# EAGLE board Schematic_rfclock_uwb (EAGLE 9.6.2)
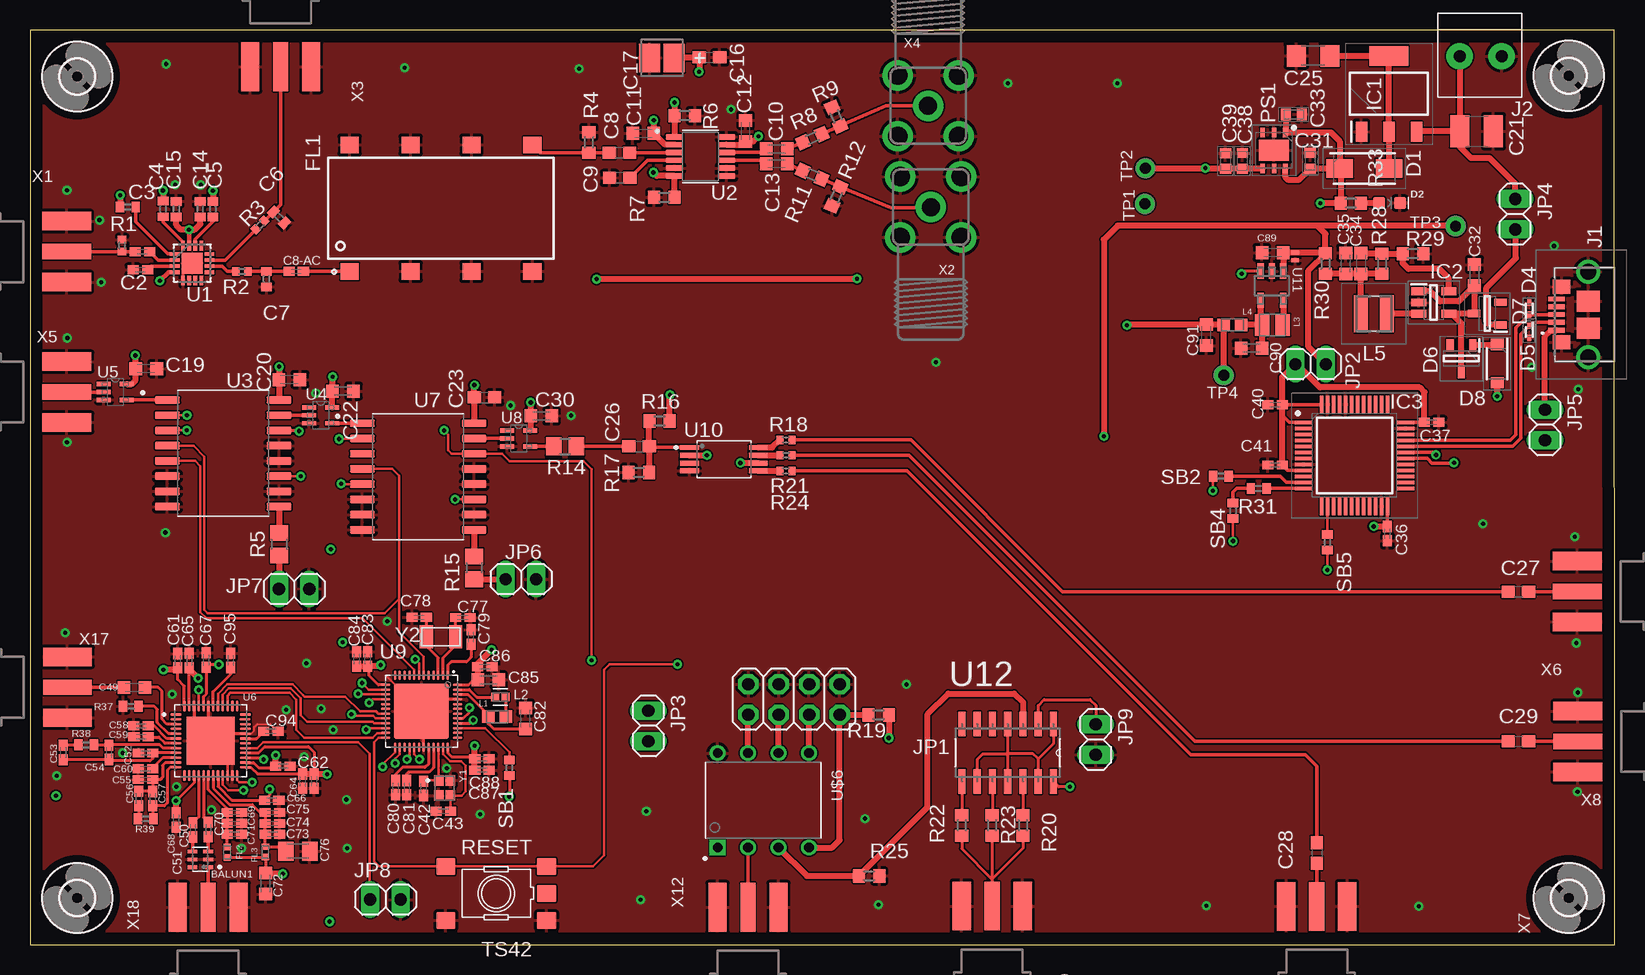
[diagram p5: board, top side]
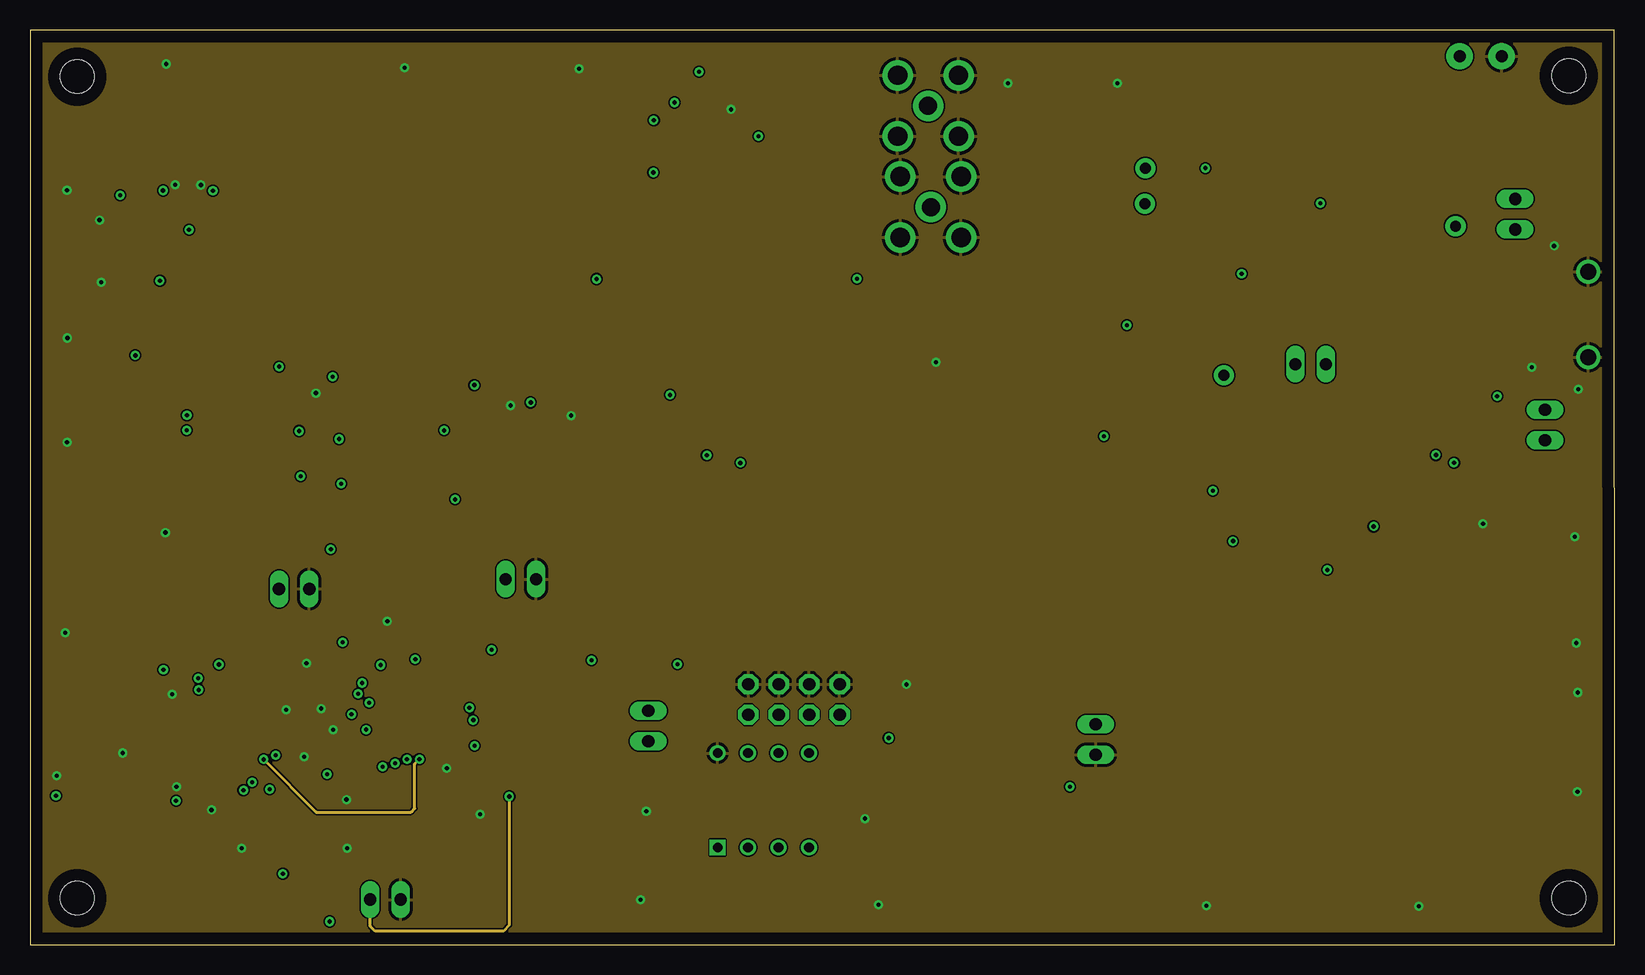
[diagram p6: board, inner layer Route2]
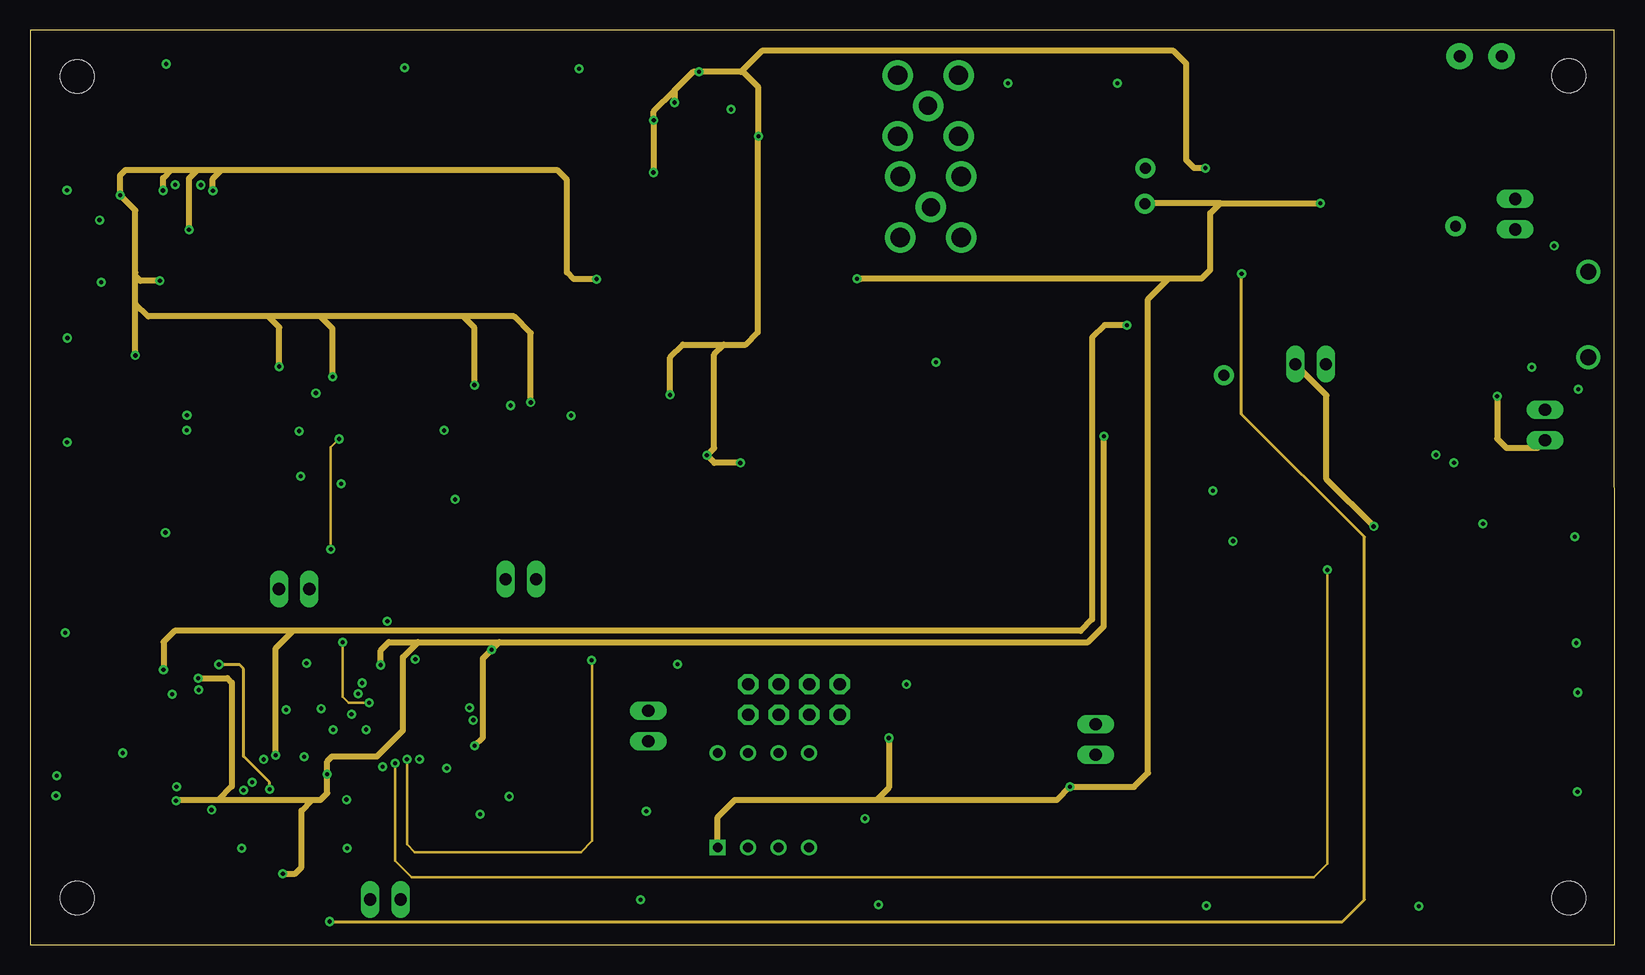
[diagram p7: board, inner layer Route15]
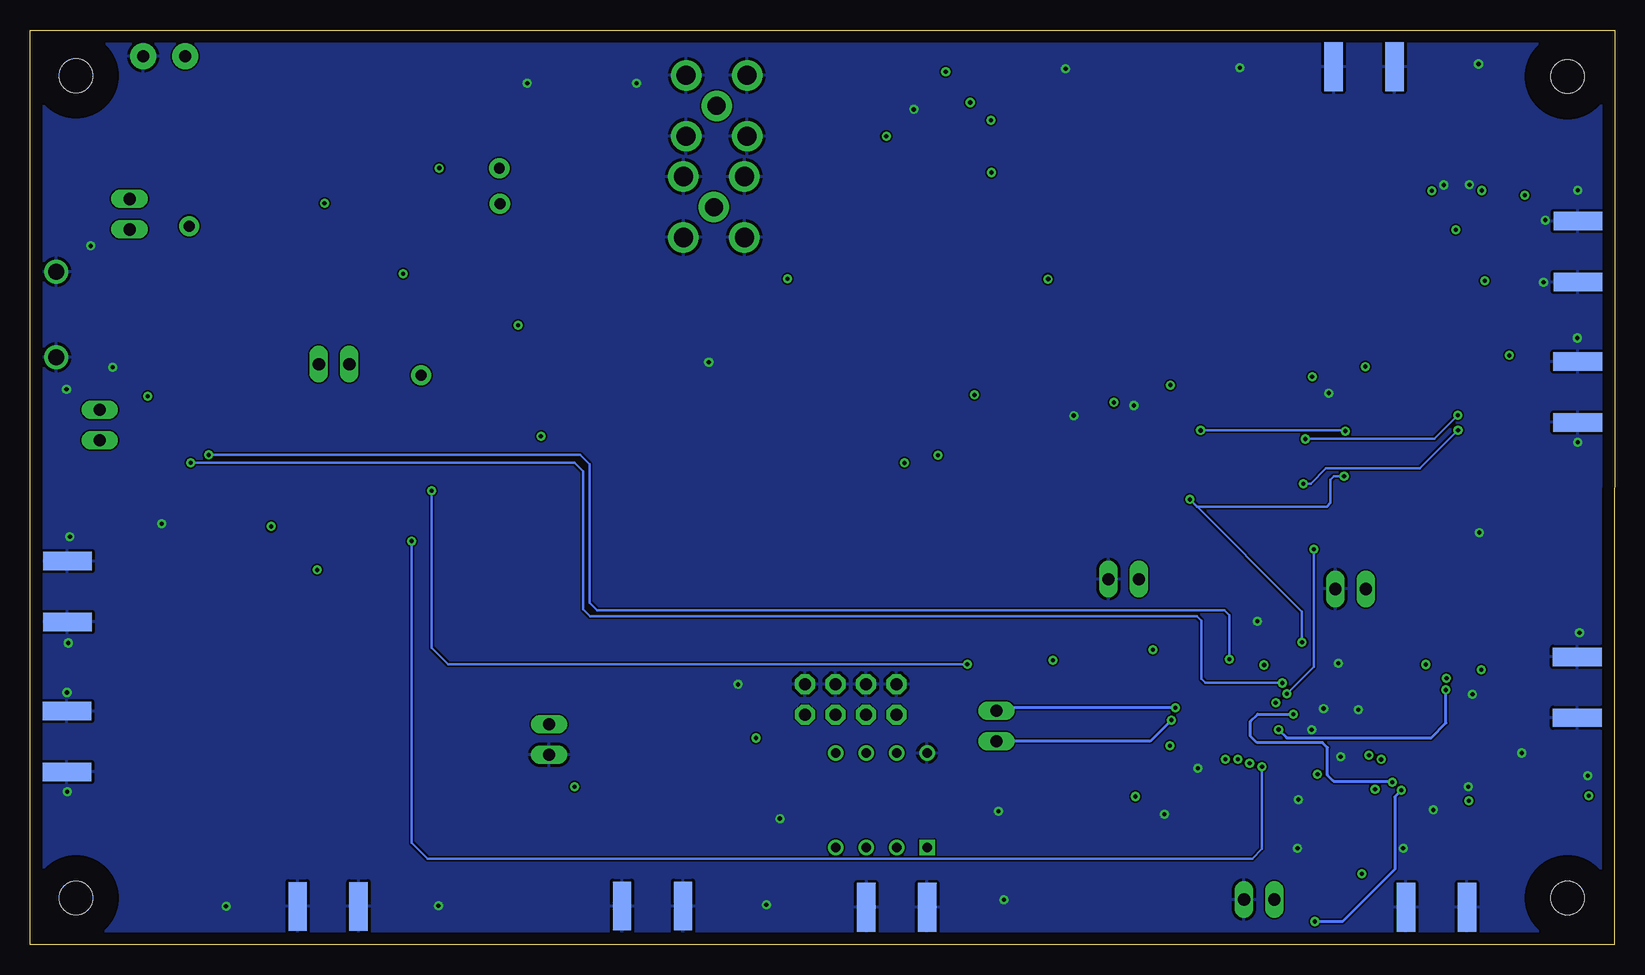
[diagram p8: board, bottom side, seen from below]

Size 132.1 x 76.24 mm. Coordinates in mm from the lower left corner, seen from the top.
Outline: 0.02,0 132.1,0 132.08,76.24 0,76.24 0.02,0
Copper layers (1+2*15+16): Top 0.035mm / dielectric 0.2mm / Route2 0.0175mm / dielectric 1.065mm / Route15 0.0175mm / dielectric 0.2mm / Bottom 0.035mm
Design rules "default *": minimum track width 6mil, minimum drill 0.35mm, track to track 5mil, track to pad 6mil, pad to pad 6mil, via to via 6mil, smd to smd 6mil, copper to edge 40mil, drill to drill 6mil, minimum pad ring 10mil, minimum via ring 8mil, stop-mask expansion 4mil, vias tented up to drill 0mil, thermal gap 10mil
Net classes: 1 diff_pairs: width 0.216 mm

## Footprints (pad centres in the part's own frame; a part is rotated, then mirrored left to right if it is on the bottom)
BALUN_HHM1595A1 = smd 0.8 x 0.3: 1 -0.65,0.65; 2 -0.65,0; 3 -0.65,-0.65; 4 0.65,-0.65; 5 0.65,0; 6 0.65,0.65
C0402K = smd 0.925 x 0.74: 1 -0.6,0; 2 0.6,0
C0402 = smd 0.7 x 0.9: 1 -0.65,0; 2 0.65,0
C0603 = smd 1.1 x 1: 1 -0.85,0; 2 0.85,0
C0603K = smd 1.05 x 1.08: 1 -0.875,0; 2 0.875,0
CAPCP3528X210N = smd 1.753 x 2.413: 1 -1.016,0; 2 1.016,0
C1210 = smd 1.6 x 2.7: 1 -1.4,0; 2 1.4,0
C1206 = smd 1.6 x 1.8: 1 -1.4,0; 2 1.4,0
CAPC1608X90N = smd 0.83 x 0.94: 1 -0.66,0; 2 0.66,0
C0805K = smd 1.3 x 1.6: 1 -1,0; 2 1,0
DIOM5126X265N = smd 2.2 x 1.55: 1 -2.05,0; 2 2.05,0
LED-0603 = smd 1 x 1: A -0.877,0; C 0.877,0
DF2S6.2CT,L3F = smd 0.35 x 0.6: 1 0,0; 2 0.65,0
SODFL1006X40N = smd 0.51 x 0.32: 1 -0.5,0; 2 0.5,0
SOT95P230X110-3N = smd 1.05 x 0.6: 1 -1.1,0.95; 2 -1.1,-0.95; 3 1.1,0
SODFL3517X110N = smd 0.92 x 1.08: 1 -1.6,0; 2 1.6,0
FIL_SXBP-101+ = smd 1.4 x 1.52: 1 -5.27,7.62; 2 5.27,7.62; 3 -5.27,2.54; 4 5.27,2.54; 5 -5.27,-2.54; 6 5.27,-2.54; 7 -5.27,-7.62; 8 5.27,-7.62
BEADC1005X55N = smd 0.54 x 0.6: 1 -0.432,0; 2 0.432,0
SOT230P700X190-4N = smd 1.65 x 0.95: 1 -3.15,2.3; 2 -3.15,0; 3 -3.15,-2.3 | smd 1.65 x 3.25: 4 3.15,0
SOT94P280X100-5N = smd 1.25 x 0.65: 1 -1.25,0.94; 2 -1.25,0; 3 -1.25,-0.94; 4 1.25,-0.94; 5 1.25,0.94
QFP50P900X900X160-48N = smd 1.475 x 0.3: 1 -4.238,2.75; 2 -4.238,2.25; 3 -4.238,1.75; 4 -4.238,1.25; 5 -4.238,0.75; 6 -4.238,0.25; 7 -4.238,-0.25; 8 -4.238,-0.75; 9 -4.238,-1.25; 10 -4.238,-1.75; 11 -4.238,-2.25; 12 -4.238,-2.75; 25 4.238,-2.75; 26 4.238,-2.25; 27 4.238,-1.75; 28 4.238,-1.25; 29 4.238,-0.75; 30 4.238,-0.25; 31 4.238,0.25; 32 4.238,0.75; 33 4.238,1.25; 34 4.238,1.75; 35 4.238,2.25; 36 4.238,2.75 | smd 0.3 x 1.475: 13 -2.75,-4.238; 14 -2.25,-4.238; 15 -1.75,-4.238; 16 -1.25,-4.238; 17 -0.75,-4.238; 18 -0.25,-4.238; 19 0.25,-4.238; 20 0.75,-4.238; 21 1.25,-4.238; 22 1.75,-4.238; 23 2.25,-4.238; 24 2.75,-4.238; 37 2.75,4.238; 38 2.25,4.238; 39 1.75,4.238; 40 1.25,4.238; 41 0.75,4.238; 42 0.25,4.238; 43 -0.25,4.238; 44 -0.75,4.238; 45 -1.25,4.238; 46 -1.75,4.238; 47 -2.25,4.238; 48 -2.75,4.238
USB307530A = smd 0.4 x 1.4: 1 -1.3,2.65; 2 -0.65,2.65; 3 0,2.65; 4 0.65,2.65; 5 1.3,2.65 | drill 1.329 pad 1.85: MH1 -3.575,0; MH2 3.575,0 | smd 1.75 x 1.9: MP1 -1.125,0; MP2 1.125,0 | smd 1.15 x 1.45: MP3 -2.32,2.23; MP4 2.32,2.23
1X2-3.5MM = drill 1 pad 2.184: 1 1.8,0; 2 -1.7,0
2X04 = drill 1.016 pad 1.676 octagon: 1 -3.81,-1.27; 2 -3.81,1.27; 3 -1.27,-1.27; 4 -1.27,1.27; 5 1.27,-1.27; 6 1.27,1.27; 7 3.81,-1.27; 8 3.81,1.27
1X02 = drill 1.016 long: 1 -1.27,0; 2 1.27,0
INDC1608X100N = smd 1.06 x 1.02: 1 -0.728,0; 2 0.728,0
INDC1005X55N = smd 0.66 x 0.72: 1 -0.43,0; 2 0.43,0
INDC2016X100N = smd 1.2 x 1.82: 1 -0.86,0; 2 0.86,0
LPS3015683MRB = smd 1.14 x 3.05: 1 -1.08,0; 2 1.08,0
SON95P300X300X100-7N = smd 0.8 x 0.4: 1 -1.5,0.95; 2 -1.5,0; 3 -1.5,-0.95; 4 1.5,-0.95; 5 1.5,0; 6 1.5,0.95 | smd 1.75 x 2.5: 7 0,0
R0402 = smd 0.6 x 0.7: 1 -0.5,0; 2 0.5,0
R0603 = smd 1 x 1.1: 1 -0.85,0; 2 0.85,0
R0805 = smd 1.3 x 1.5: 1 -0.95,0; 2 0.95,0
R0402' = smd 0.7 x 0.9: 1 -0.65,0; 2 0.65,0
TS42 = smd 1.6 x 1.4: 1 -4.2,2.25; 2 4.2,2.25; 3 -4.2,-2.25; 4 4.2,-2.25; 5 -4.2,0
TESTPOINT_PAD-036 = drill 0.914 pad 1.676: 1 0,0
QFN50P300X300X80-17N = smd 0.813 x 0.305: 1 -1.448,0.762; 2 -1.448,0.254; 3 -1.448,-0.254; 4 -1.448,-0.762; 9 1.448,-0.762; 10 1.448,-0.254; 11 1.448,0.254; 12 1.448,0.762 | smd 0.305 x 0.813: 5 -0.762,-1.448; 6 -0.254,-1.448; 7 0.254,-1.448; 8 0.762,-1.448; 13 0.762,1.448; 14 0.254,1.448; 15 -0.254,1.448; 16 -0.762,1.448 | smd 1.753 x 1.753: 17 0,0
SOP65P490X110-12N = smd 1.45 x 0.48: 1 -2.16,1.625; 2 -2.16,0.975; 3 -2.16,0.325; 4 -2.16,-0.325; 5 -2.16,-0.975; 6 -2.16,-1.625; 7 2.16,-1.625; 8 2.16,-0.975; 9 2.16,-0.325; 10 2.16,0.325; 11 2.16,0.975; 12 2.16,1.625
SOIC127P1032X265-16N = smd 2.05 x 0.59: 1 -4.655,4.445; 2 -4.655,3.175; 3 -4.655,1.905; 4 -4.655,0.635; 5 -4.655,-0.635; 6 -4.655,-1.905; 7 -4.655,-3.175; 8 -4.655,-4.445; 9 4.655,-4.445; 10 4.655,-3.175; 11 4.655,-1.905; 12 4.655,-0.635; 13 4.655,0.635; 14 4.655,1.905; 15 4.655,3.175; 16 4.655,4.445
SOT65P210X110-5N = smd 1.168 x 0.356: 1 -0.965,0.66; 2 -0.965,0; 3 -0.965,-0.66; 4 0.965,-0.66; 5 0.965,0.66
QFN40P600X600X90-49N = smd 0.91 x 0.22: 1 -2.9,2.2; 2 -2.9,1.8; 3 -2.9,1.4; 4 -2.9,1; 5 -2.9,0.6; 6 -2.9,0.2; 7 -2.9,-0.2; 8 -2.9,-0.6; 9 -2.9,-1; 10 -2.9,-1.4; 11 -2.9,-1.8; 12 -2.9,-2.2; 25 2.9,-2.2; 26 2.9,-1.8; 27 2.9,-1.4; 28 2.9,-1; 29 2.9,-0.6; 30 2.9,-0.2; 31 2.9,0.2; 32 2.9,0.6; 33 2.9,1; 34 2.9,1.4; 35 2.85,1.8; 36 2.9,2.2 | smd 0.22 x 0.91: 13 -2.2,-2.9; 14 -1.8,-2.9; 15 -1.4,-2.9; 16 -1,-2.9; 17 -0.6,-2.9; 18 -0.2,-2.9; 19 0.2,-2.9; 20 0.6,-2.9; 21 1,-2.9; 22 1.4,-2.9; 23 1.8,-2.9; 24 2.2,-2.9; 37 2.2,2.9; 38 1.8,2.9; 39 1.4,2.9; 40 1,2.9; 41 0.6,2.9; 42 0.2,2.9; 43 -0.2,2.9; 44 -0.6,2.9; 45 -1,2.9; 46 -1.4,2.9; 47 -1.8,2.9; 48 -2.2,2.9 | smd 4 x 4: 49 0,0
QFN40P600X600X90-49N' = smd 0.81 x 0.22: 1 -3,2.2; 2 -3,1.8; 3 -3,1.4; 4 -3,1; 5 -3,0.6; 6 -3,0.2; 7 -3,-0.2; 8 -3,-0.6; 9 -3,-1; 10 -3,-1.4; 11 -3,-1.8; 12 -3,-2.2; 25 3,-2.2; 26 3,-1.8; 27 3,-1.4; 28 3,-1; 29 3,-0.6; 30 3,-0.2; 31 3,0.2; 32 3,0.6; 33 3,1; 34 3,1.4; 35 3,1.8; 36 3,2.2 | smd 0.22 x 0.81: 13 -2.2,-3; 14 -1.8,-3; 15 -1.4,-3; 16 -1,-3; 17 -0.6,-3; 18 -0.2,-3; 19 0.2,-3; 20 0.6,-3; 21 1,-3; 22 1.4,-3; 23 1.8,-3; 24 2.2,-3; 37 2.2,3; 38 1.8,3; 39 1.4,3; 40 1,3; 41 0.6,3; 42 0.2,3; 43 -0.2,3; 44 -0.6,3; 45 -1,3; 46 -1.4,3; 47 -1.8,3; 48 -2.2,3 | smd 4.6 x 4.6: 49 0,0
SOP65P640X120-8N = smd 1.57 x 0.41: 1 -2.87,0.975; 2 -2.87,0.325; 3 -2.87,-0.325; 4 -2.87,-0.975; 5 2.87,-0.975; 6 2.87,-0.325; 7 2.87,0.325; 8 2.87,0.975
SOT95P284X122-5N = smd 1.27 x 0.533: 1 -1.219,0.94; 2 -1.219,0; 3 -1.219,-0.94; 4 1.219,-0.94; 5 1.219,0.94
SOIC127P600X175-14N = smd 2.057 x 0.61: 1 -4.801,7.62; 2 -4.801,6.35; 3 -4.801,5.08; 4 -4.801,3.81; 5 -4.801,2.54; 6 -4.801,1.27; 7 -4.801,0; 8 0,0; 9 0,1.27; 10 0,2.54; 11 0,3.81; 12 0,5.08; 13 0,6.35; 14 0,7.62
2,8 = hole 2.8: 0,0
DIP787W46P254L927H533Q8 = drill 0.8 square: 1 -3.935,3.81 | drill 0.8: 2 -3.935,1.27; 3 -3.935,-1.27; 4 -3.935,-3.81; 5 3.935,-3.81; 6 3.935,-1.27; 7 3.935,1.27; 8 3.935,3.81
SMA_EDGELAUNCH = smd 4.064 x 1.524: GND@1 2.032,-2.54; GND@2 2.032,2.54 | smd 4.064 x 1.524 bottom: GND@3 2.032,2.54; GND@4 2.032,-2.54 | smd 4.064 x 1.27: P 2.032,0
SMA90_DIP = drill 1.5 pad 2.54: ANTENNA 0,0 | drill 1.6 pad 2.54: GND1 -2.54,2.54; GND2 2.54,2.54; GND3 -2.54,-2.54; GND4 2.54,-2.54
XTAL_ABM11W-32.0000MHZ-8-B1U-T3 = smd 0.775 x 0.875: 1 -0.487,0.637; 2 -0.487,-0.637; 3 0.487,-0.637; 4 0.487,0.637
XTAL320X150X90 = smd 1.092 x 1.905: 1 -1.219,0; 2 1.219,0

## Placement (x,y rotation side)
BALUN1  HHM1595A1  [BALUN_HHM1595A1]  14.2,7.11 180 top
C1  [C0402K]  9.37,57.77 0 top
C2  [C0402K]  9.2,56.26 0 top
C3  [C0402]  8.16,61.49 0 top
C4  [C0402]  11.09,61.33 270 top
C5  [C0402]  15.25,61.3 270 top
C6  [C0402]  20.76,60.63 315 top
C7  [C0402]  19.71,55.47 270 top
C8  [C0603]  49.14,66.03 0 top
C8-AC  [C0402K]  22.19,56.12 0 top
C9  [C0603]  49.16,63.92 180 top
C10  [C0603K]  62.24,66.33 0 top
C11  [C0603K]  51.12,67.62 180 top
C12  [C0603K]  59.65,67.83 90 top
C13  [C0603K]  62.24,65.09 0 top
C14  [C0402]  14.19,61.31 90 top
C15  [C0402]  12.19,61.3 90 top
C16  [C0603]  56.65,73.96 0 top
C17  22UF  [CAPCP3528X210N]  52.68,73.91 180 top
C19  [C0603K]  9.68,48.01 0 top
C20  [C0603K]  21.63,47.1 0 top
C21  10uF(25V)  [C1210]  120.59,67.8 0 top
C22  [C0603K]  26.09,46.15 0 top
C23  [C0603]  37.89,45.61 0 top
C25  10uF  [C1206]  106.95,74.09 180 top
C26  1u  [C0603]  50.77,41.53 0 top
C27  1u  [C0603]  124.07,29.44 0 top
C28  1u  [C0603]  107.25,7.66 270 top
C29  1u  [C0603]  124.07,16.95 0 top
C30  [C0603K]  42.61,44.08 0 top
C31  CC0603KRX7R9BB104  [CAPC1608X90N]  106.72,65.35 90 top
C32  [C0603K]  120.41,55.82 90 top
C33  CC0603KRX5R7BB105  [CAPC1608X90N]  105.34,69.2 0 top
C34  [C0603K]  110.95,56.78 90 top
C35  [C0603K]  109.68,56.78 90 top
C36  [C0402K]  113.15,34.26 270 top
C37  [C0402K]  116.84,43.55 0 top
C38  CC0603KRX5R7BB105  [CAPC1608X90N]  101.05,65.33 90 top
C39  CC0603KRX7R9BB104  [CAPC1608X90N]  99.66,65.33 90 top
C40  [C0402K]  103.79,45.01 180 top
C41  [C0402K]  103.79,39.99 180 top
C42  [C0402K]  32.8,13.04 270 top
C43  [C0402K]  34.46,11.12 180 top
C49  [C0603K]  8.71,21.45 0 top
C50  [C0402K]  14.87,9.61 90 top
C51  [C0402K]  13.58,9.58 90 top
C52  [C0402K]  9.64,15.99 180 top
C53  [C0402K]  2.77,16.02 270 top
C54  [C0402K]  6.58,16.04 270 top
C55  [C0402K]  9.63,13.78 180 top
C56  [C0402K]  9.07,12.19 90 top
C57  [C0402K]  10.23,12.18 90 top
C58  [C0402K]  9.26,18.24 180 top
C59  [C0402K]  9.27,17.33 180 top
C60  [C0402K]  9.62,14.68 180 top
C61  [C0402K]  12.3,23.67 90 top
C62  [C0402K]  21.09,14.9 0 top
C63  [C0402K]  23.69,13.64 270 top
C64  [C0402K]  22.73,13.64 270 top
C65  [C0402K]  13.28,23.69 90 top
C66  [C0402K]  20.15,12.06 0 top
C67  [C0402K]  14.68,23.74 90 top
C68  [C0402K]  12.18,10.41 270 top
C69  [C0402K]  17.04,11.03 0 top
C70  [C0402K]  17.04,10.12 0 top
C71  [C0402K]  17.04,9.21 0 top
C72  [C0603K]  19.63,5.11 270 top
C73  [C0402K]  20.22,9.22 0 top
C74  [C0402K]  20.21,10.11 0 top
C75  [C0402K]  20.22,11.03 0 top
C76  [C0805K]  22.32,7.8 0 top
C77  [C0402K]  36.09,27.28 0 top
C78  [C0402K]  32.44,27.29 180 top
C79  [C0402K]  36.76,25.65 90 top
C80  [C0402K]  30.48,13.1 270 top
C81  [C0402K]  31.41,13.09 270 top
C82  [C0603K]  41.3,18.88 90 top
C83  [C0402K]  28.15,23.82 90 top
C84  [C0402K]  27.23,23.82 90 top
C85  [C0603K]  38.2,22.08 0 top
C86  [C0402K]  37.91,23.18 0 top
C87  [C0402K]  37.68,15.51 0 top
C88  [C0402K]  37.68,14.56 0 top
C89  [C0603K]  103.57,57.68 180 top
C90  [C0603K]  101.83,49.73 180 top
C91  [C0603K]  98.05,50.81 270 top
C94  [C0402K]  20.09,17.79 0 top
C95  [C0402K]  16.72,23.71 90 top
D1  STPS2L30A  [DIOM5126X265N]  111.23,64.7 0 top
D2  RED  [LED-0603]  113.33,61.83 0 top
D3  DF2S6.2CT,L3F  [DF2S6.2CT,L3F]  105.47,57.04 90 top
D4  ESD9101P2T5G  [SODFL1006X40N]  124.97,53.03 90 top
D5  ESD9101P2T5G  [SODFL1006X40N]  124.97,51.08 270 top
D6  PMEG2005ET,215  [SOT95P230X110-3N]  119.32,48.86 270 top
D7  PMEG2005ET,215  [SOT95P230X110-3N]  121.48,52.6 180 top
D8  PMEG4020ER,115  [SODFL3517X110N]  122.3,48.43 270 top
FL1  SXBP-101+  [FIL_SXBP-101+]  34.26,61.39 90 top
FL2  BLM15AG601SN1D  [BEADC1005X55N]  16.44,7.71 270 top
FL3  BLM15AG601SN1D  [BEADC1005X55N]  19.62,7.74 270 top
IC1  LD1117S50TR  [SOT230P700X190-4N]  113.28,70.92 90 top
IC2  RT8059GJ5  [SOT94P280X100-5N]  117.01,53.53 0 top
IC3  STM32F072CBT6  [QFP50P900X900X160-48N]  110.4,40.79 0 top
J1  USB3075-30-A  [USB307530A]  129.9,52.53 90 top
J2  1X2-3.5MM  [1X2-3.5MM]  120.97,74.04 180 top
JP1  [2X04]  63.69,20.45 180 top
JP2  [1X02]  106.75,48.39 180 top
JP3  [1X02]  51.54,18.24 270 top
JP4  [1X02]  123.8,60.89 270 top
JP5  [1X02]  126.29,43.32 270 top
JP6  [1X02]  40.93,30.48 0 top
JP7  [1X02]  22.02,29.66 0 top
JP8  SYNC  [1X02]  29.63,3.78 0 top
JP9  [1X02]  88.84,17.11 270 top
L1  LBMF1608T100K  [INDC1608X100N]  38.94,19.02 0 top
L2  HK100515NJ-T  [INDC1005X55N]  39.21,20.64 180 top
L3  CKP20162R2M-T  [INDC2016X100N]  103.56,51.66 180 top
L4  LBMF1608T100K  [INDC1608X100N]  100.23,51.66 180 top
L5  LPS3015-683MRB  [LPS3015683MRB]  112.02,52.59 180 top
PS1  LD39050PU33R  [SON95P300X300X100-7N]  103.7,66.2 270 top
R1  [R0402]  7.68,58.27 90 top
R2  [R0402]  17.67,56.12 180 top
R3  [R0402]  19.18,59.98 225 top
R4  [R0603]  46.59,66.87 90 top
R5  [R0805]  20.77,33.38 270 top
R6  [R0603]  54.58,69.1 180 top
R7  [R0603]  52.88,62.29 0 top
R8  [R0603]  65.21,67.23 203.4 top
R9  [R0603]  67.2,69.02 113.4 top
R11  [R0603]  65.2,64.17 156.6 top
R12  [R0603]  67.2,62.38 246.6 top
R14  [R0805]  44.6,41.54 0 top
R15  [R0805]  37.02,31.42 270 top
R16  [R0603]  52.48,43.65 0 top
R17  [R0603]  50.75,39.37 0 top
R18  [R0402]  63.01,42.08 0 top
R19  [R0603]  70.74,19.16 180 top
R20  [R0603]  82.78,9.96 270 top
R21  [R0402]  63.01,39.5 0 top
R22  [R0603]  77.67,9.96 270 top
R23  [R0603]  80.2,9.96 270 top
R24  [R0402]  63.03,40.8 0 top
R25  [R0603]  69.95,5.74 180 top
R28  1k  [R0603]  112.69,56.76 90 top
R29  1k  [R0603]  115.28,57.6 0 top
R30  1k  [R0603]  107.98,56.77 90 top
R31  [R0402']  102.42,38.03 0 top
R33  1k  [R0603]  110.11,61.81 180 top
R37  [R0402']  8.41,19.88 0 top
R38  [R0402']  4.68,16.67 0 top
R39  [R0402']  9.64,10.51 0 top
RESET  TS42  [TS42]  38.86,4.29 180 top
SB1  [R0402']  39.97,14.75 90 top
SB2  [R0402']  99.27,39.06 180 top
SB4  [R0402']  100.28,36.18 270 top
SB5  [R0402']  108.15,33.54 270 top
TP1  TESTPOINT_TPS-PAD-036  [TESTPOINT_PAD-036]  92.93,61.75 180 top
TP2  TESTPOINT_TPS-PAD-036  [TESTPOINT_PAD-036]  92.98,64.72 180 top
TP3  TESTPOINT_TPS-PAD-036  [TESTPOINT_PAD-036]  118.83,59.9 180 top
TP4  TESTPOINT_TPS-PAD-036  [TESTPOINT_PAD-036]  99.51,47.47 270 top
U1  ADL5511ACPZ-R7  [QFN50P300X300X80-17N]  13.52,56.81 0 top
U2  LTC6957HMS-4#PBF  [SOP65P490X110-12N]  55.9,65.7 0 top
U3  DS1023S-25+T  [SOIC127P1032X265-16N]  16.1,40.96 0 top
U4  74LVC1G04GW  [SOT65P210X110-5N]  24.24,44.13 0 top
U5  74LVC1G04GW  [SOT65P210X110-5N]  7.11,46.07 0 top
U6  DW1000-I  [QFN40P600X600X90-49N]  15.07,17 0 top
U7  DS1023S-25+T  [SOIC127P1032X265-16N]  32.36,39.03 0 top
U8  74LVC1G04GW  [SOT65P210X110-5N]  40.74,42.2 0 top
U9  NRF52832-QFAA-R  [QFN40P600X600X90-49N']  32.63,19.47 270 top
U10  CDCLVC1104PWR  [SOP65P640X120-8N]  57.84,40.47 0 top
U11  LM3671MF-1.8  [SOT95P284X122-5N]  103.52,54.93 270 top
U12  SN74AC04D  [SOIC127P600X175-14N]  77.69,13.61 270 top
U$1  [2,8]  128.27,3.9 0 top
U$2  [2,8]  128.27,72.43 0 top
U$3  [2,8]  3.94,72.36 0 top
U$4  [2,8]  3.94,3.9 0 top
U$6  PIC12F675-I/P  [DIP787W46P254L927H533Q8]  61.13,12.04 90 top
X1  RFIN  [SMA_EDGELAUNCH]  1.03,57.77 0 top
X2  [SMA90_DIP]  75.08,61.49 180 top
X3  [SMA_EDGELAUNCH]  20.89,75.2 270 top
X4  CLKOUT  [SMA90_DIP]  74.87,69.92 0 top
X5  [SMA_EDGELAUNCH]  1.04,46.07 0 top
X6  [SMA_EDGELAUNCH]  131.02,29.45 180 top
X7  CLKD_OUT  [SMA_EDGELAUNCH]  107.26,1.17 90 top
X8  [SMA_EDGELAUNCH]  131.06,16.95 180 top
X9  PPSOUT  [SMA_EDGELAUNCH]  80.2,1.2 90 top
X12  [SMA_EDGELAUNCH]  59.85,1.09 90 top
X17  CLKIN  [SMA_EDGELAUNCH]  1.09,21.46 0 top
X18  UWB  [SMA_EDGELAUNCH]  14.85,1.09 90 top
Y1  ABM11W-32.0000MHZ-8-B1U-T3  [XTAL_ABM11W-32.0000MHZ-8-B1U-T3]  34.56,13.07 0 top
Y2  ABS07-32.768KHZ-1-T  [XTAL320X150X90]  34.26,25.69 180 top

## Tracks (layer width: path | path; a pad name or v marks a point on that pad's centre or on a via)
1V8  (via drill 0.35)
  Top 0.254: U6.48 12.87,21.56 12.3,22.13 C61.1 | U6.26 18.63,15.19 19.06,14.77 20.36,14.77 C62.1
  Top 0.508: v91.42,51.64 91.46,51.68 C91.1 98.07,51.66 L4.2 99.51,51.65 TP4.1 | C61.1 12.16,22.94 v11.13,22.94 | C62.1 20.48,14.91 v20.48,15.81
  Route15 0.508: v91.42,51.64 89.56,51.64 88.54,50.61 88.54,27.11 87.59,26.17 21.93,26.17 | 21.93,26.17 12.05,26.17 11.13,25.24 v11.13,22.94 | v20.48,15.81 20.48,24.72 21.93,26.17
3V3  (via drill 0.35)
  Top 0.483: R7.2 53.73,64.06 U2.6
  Top 0.508: U2.1 53.71,67.36 R6.2 v53.73,70.2 | v52,68.72 C11.1 | C11.1 | PS1.4 102.72,64.67 C38.1 C39.1 98.05,64.66 97.99,64.72 | C17.1 55.74,73.91 C16.1 55.79,72.79 v55.76,72.76 | 97.99,64.72 v97.98,64.73 | U2.2 52.94,66.68 C11.1 | U2.6 52.24,64.08 v51.96,64.36 | R16.2 53.33,45.79 v53.36,45.83 | U10.2 v56.42,40.8 v56.42,40.79 | v59.21,40.16 60.69,40.16 U10.6 | TP2.1 97.99,64.72 | v60.72,67.39 60.28,66.95 C12.1 59.38,66.68 U2.11
  Route15 0.508: 53.73,71.19 53.73,71.2 55.29,72.76 v55.76,72.76 59.25,72.76 59.34,72.84 | 53.73,71.19 v53.73,70.2 | v97.98,64.73 97.06,64.73 96.39,65.4 96.39,73.44 95.33,74.5 61,74.5 59.34,72.84 | 59.34,72.84 60.72,71.46 v60.72,67.39 60.66,67.33 60.66,51.03 59.65,50.02 57.85,50.02 | 53.73,71.19 52,69.46 v52,68.72 52,64.39 v51.96,64.36 | v53.36,45.83 53.36,48.96 54.43,50.02 57.85,50.02 | 57.85,50.02 57.03,49.2 57.03,41.4 v56.42,40.79 57.05,40.16 v59.21,40.16
3V4  (via drill 0.35)
  Top 0.216: 13.27,23.07 C65.1
  Top 0.254: U9.36 34.83,16 35.16,15.66 36.93,15.66 C87.1 | U6.47 13.27,23.07 | U6.25 18.41,14.79 18.96,14.24 C64.1 | U6.28 19.06,15.99 19.58,16.51 23.22,16.51 23.69,16.04 C63.1 | U9.13 29.03,21.67 28.25,22.44 28.25,23.32 | U6.15 13.67,13.49 12.19,12.01 v12.17,12.01 | FL2.2 16.47,7.31 FL3.2 19.63,7.3 C72.1 | U9.48 36.56,21.67 36.98,22.09 37.31,22.09
  Top 0.508: R30.2 107.98,59.25 107.3,59.93 | 107.3,59.93 90.67,59.93 89.51,58.77 v89.51,42.38 | v38.48,24.6 37.31,23.42 C86.1 37.31,22.09 C85.1 | v37.07,16.6 37.07,15.52 C87.1 C88.1 | R30.2 107.91,57.69 D3.2 C89.1 104.46,57.67 U11.1 | 28.25,23.32 C83.1 | JP2.1 106.58,49.83 106.58,56.2 R30.2 | TP3.1 118.8,59.93 107.3,59.93 | C68.1 v12.17,12.01 | v14.02,22.22 13.28,22.96 C65.1 | C72.1 21.01,5.98 v21.08,5.92 | C64.1 C63.1 23.72,14.21 v24.77,14.21 | v29.23,23.32 29.12,23.22 C83.1 | C84.1 C83.1
  Route15 0.508: 39.11,25.23 v38.48,24.6 37.75,23.87 37.75,17.27 v37.07,16.6 | v89.51,42.38 89.51,26.54 88.19,25.23 39.11,25.23 | v29.23,23.32 29.23,24.55 29.91,25.23 32.35,25.23 | 32.35,25.23 31.1,23.98 31.1,17.87 28.93,15.7 25.19,15.7 24.77,15.29 v24.77,14.21 24.77,12.63 24.19,12.05 23.49,12.05 | 39.11,25.23 32.35,25.23 | 23.49,12.05 15.67,12.05 | v12.17,12.01 12.21,12.05 15.67,12.05 | v14.02,22.22 16.47,22.22 16.83,21.86 16.83,13.21 15.67,12.05 | v21.08,5.92 22.04,5.92 22.06,5.9 22.63,6.47 22.63,11.18 23.49,12.05
3V4_SEGGER  (via drill 0.35)
  Top 0.305: IC3.9 104.83,39.54 C41.1 | C40.1 107.63,45.01 IC3.48 | IC3.24 C36.1 | IC3.36 116.3,43.54 C37.1 | 104.38,44.13 104.97,43.54 IC3.1
  Top 0.508: C41.1 104.38,44.13 C40.1 104.39,47.3 JP2.2 105.61,48.39 107.54,46.46 115.84,46.46 116.24,46.06 C37.1 | C36.1 v112.01,34.86 v112,34.87
  Route15 0.508: v112,34.87 108.08,38.79 108.08,45.8 JP2.2
5V  (via drill 0.35)
  Top 0.254: v86.69,13.17 85.76,13.17 U12.14
  Top 0.381: U1.15 v13.26,59.59 | U1.4 11.55,56.05 v10.83,55.33
  Top 0.508: v11.09,62.86 C4.1 | v7.51,62.48 C3.1 | v15.25,62.84 C5.1 | C15.1 12.19,59.97 12.57,59.6 v13.26,59.6 | C14.1 14.19,60.06 13.73,59.6 v13.26,59.6 | v13.26,59.59 v13.26,59.6 | v41.74,45.2 C30.1 41.74,42.89 U8.5 | v20.78,48.19 20.78,47.11 C20.1 | D1.1 109.26,64.62 R33.2 v107.56,61.81 v107.55,61.8 | D1.1 C31.1 105.75,63.72 104.9,63.72 104.65,63.96 PS1.6 | C33.1 104.68,67.73 PS1.1 108.44,67.7 109.18,66.96 D1.1 | C20.1 | C20.1 U3.16 | U4.5 C22.1 v25.21,47.33 v25.22,47.33 | U7.16 37.04,43.5 C23.1 v37.04,46.64 v37.04,46.65 | v47.23,55.48 | v47.23,55.48 68.93,55.48 v68.94,55.5 | R19.1 v71.59,17.24 v71.59,17.23 | U5.5 8.47,46.73 8.81,47.07 C19.1 8.78,48.04 v8.78,49.12
  Route15 0.508: v13.26,59.6 13.26,63.87 13.97,64.58 | 13.97,64.58 15.97,64.58 | 15.97,64.58 43.93,64.58 44.76,63.74 44.76,56.04 45.32,55.48 v47.23,55.48 | v15.25,62.84 15.25,63.86 15.97,64.58 | v11.09,62.86 11.09,63.89 11.78,64.58 | 11.78,64.58 13.97,64.58 | 11.78,64.58 7.96,64.58 7.51,64.12 v7.51,62.48 8.78,61.2 8.78,56.03 | v10.83,55.33 9.2,55.33 8.78,55.75 8.78,56.03 | 8.78,53.44 8.78,56.03 | 8.78,56.03 | v20.78,48.19 20.78,51.46 19.86,52.37 | 19.86,52.37 9.85,52.37 8.78,53.44 | v25.22,47.33 25.22,51.35 24.19,52.37 | 24.19,52.37 19.86,52.37 | v37.04,46.65 37.04,51.41 36.09,52.37 | 36.09,52.37 24.19,52.37 | v41.74,45.2 41.74,50.98 40.35,52.37 36.09,52.37 | v68.94,55.5 69.26,55.5 69.27,55.51 94.9,55.51 | 94.9,55.51 97.65,55.51 98.39,56.25 98.39,60.98 99.22,61.8 | 99.22,61.8 v107.55,61.8 | TP1.1 92.98,61.8 99.22,61.8 | 94.9,55.51 93.2,53.81 93.2,14.33 92.04,13.17 v86.69,13.17 85.58,12.06 70.55,12.06 | U$6.1 57.32,10.64 58.73,12.06 70.55,12.06 | v71.59,17.23 71.59,13.09 70.55,12.06 | v8.78,49.12 8.78,53.44
CMOS
  Top 0.312: R8.1 R9.1 71.34,69.92 X4.ANTENNA
D+
  Top 0.305: IC3.33 123.39,42.04 123.85,42.5 123.85,51.41 D4.1 J1.3
D-
  Top 0.305: J1.2 125.26,51.88 D5.1 124.28,50.89 124.28,42.21 123.62,41.54 IC3.32
DL_LE  (via drill 0.35)
  Top 0.216: U3.2 v13.08,44.14 | v25.78,42.16 27.66,42.16 U7.2 | U9.15 27.39,20.87 v27.34,20.91
  Route15 0.216: v25.08,32.98 25.08,41.45 v25.78,42.16
  Bottom 0.216: v25.78,42.16 v25.77,42.16 15.05,42.16 v13.08,44.13 v13.08,44.14 | v27.34,20.91 25.08,23.18 v25.08,32.98
DL_MS  (via drill 0.35)
  Top 0.216: U3.11 v22.56,39.06 | U7.11 v35.42,37.12 | U9.16 28.56,20.47 v28.26,20.17
  Top 0.381: U7.11
  Route15 0.216: v28.26,20.17 26.57,20.17 26.06,20.67 v26.06,25.21
  Bottom 0.216: v22.56,39.06 23.4,39.06 23.68,38.77 23.68,36.82 23.99,36.52 34.82,36.52 v35.42,37.12 26.06,27.76 v26.06,25.21
DL_P/S  (via drill 0.35)
  Top 0.216: U9.28 31.63,15.68 v31.42,15.47 | v46.82,23.72 46.82,39.65 46.15,40.31 39.96,40.31 39.34,40.93 U7.14 35.13,40.93 34.87,41.2 34.87,42.52 v34.51,42.87
  Top 0.254: U3.14 22.39,42.87 v22.45,42.82
  Route15 0.216: v31.42,15.47 31.42,8.38 32.06,7.73 45.92,7.73 46.86,8.67 46.86,23.72 v46.82,23.72
  Bottom 0.216: v34.51,42.87 23.33,42.87 22.5,42.87
  Bottom 0.254: 22.5,42.87 v22.45,42.82
DW_CS  (via drill 0.35)
  Top 0.216: U6.24 17.27,13.72 17.43,13.55 v18.53,13.55 | U9.20 28.81,18.87 28.61,19.07 26.94,19.07 v26.8,19.21 v26.8,19.23
  Bottom 0.254: v18.53,13.55 18.62,13.64 23.45,13.64 23.95,14.14 23.95,16.43 24.37,16.84 29.82,16.84 30.35,17.37 30.35,18.63 29.75,19.23 v26.8,19.23
DW_EXTON  (via drill 0.35)
  Top 0.216: U6.21 16.07,13.33 16.52,12.88 v17.8,12.88
  Top 0.254: U11.3 101.22,56.15 v101,55.93
  Route15 0.216: v101,55.92 v101,55.93
  Route15 0.254: v24.99,1.94 109.4,1.94 111.23,3.77 111.23,34 101,44.23 v101,55.92
  Bottom 0.254: v17.8,12.88 18.35,12.33 18.35,6.28 22.68,1.94 v24.99,1.94
DW_IRQ  (via drill 0.35)
  Top 0.216: U6.45 v14.07,21.24 | U9.22 28.15,18.07 v28.02,17.94
  Top 0.312: v14.07,21.24
  Bottom 0.254: v28.02,17.94 27.33,17.25 15.31,17.25 14.07,18.49 v14.07,21.24
DW_RST  (via drill 0.35)
  Top 0.216: U9.29 32.03,15.9 v32.46,15.46
  Top 0.254: U6.27 19.33,15.59 v19.47,15.45
  Route2 0.254: v19.47,15.45 23.87,11.06 31.76,11.06 32.08,11.37 32.08,15.08 v32.46,15.46
GND  (via drill 0.35)
  Top 0.152: U6.32 18.43,17.6 18.68,17.85 18.68,18.13 18.94,18.39 20.04,18.39 20.64,17.79 C94.2 | 32.6,19.47 U9.49 29.65,22.45 29.63,22.45
  Top 0.216: U6.22 16.47,15.84 15.07,17.24
  Top 0.254: U6.43 14.87,18.36 15.07,18.16 15.07,17.58 | 15.07,17.58 15.07,17.24 U6.49 13.67,18.39 U6.46 | U6.32 15.08,17.59 15.07,17.58 | U9.31 32.83,19.27 | 32.83,19.27 U9.49 | U9.45 34.03,20.47 32.83,19.27 | U1.5 12.76,56.05 U1.17
  other vias: 12.11,63.33 14.24,63.32 98.05,3.25 115.76,3.23 11.29,34.36 3.12,50.57 3.09,41.89 2.93,26.01 40.07,44.95 45.1,44.11 23.83,45.98 58.43,69.62 129.02,21.03 128.99,12.77 3.08,62.89 128.9,25.15 128.77,34 5.8,60.4 5.93,55.22 24.27,19.69 25.26,17.92 15.13,11.24 12.21,13.17 29.78,26.97 37.53,10.88 26.38,12.11 26.44,8.04 23.05,23.47 21.36,19.6 125.2,48.14 129.06,46.29 127.05,58.25 34.74,14.7 22.84,15.67 11.86,20.88 2.24,14.1 7.74,15.99 17.64,8.06 11.35,73.41 31.24,73.08 45.77,73 81.53,71.81 90.65,71.81 51.37,11.13 50.9,3.76 70.72,3.34 69.59,10.52 73.07,21.7 75.52,48.54 121.12,35.09
  pour Top: -0.09,76.46 -0.09,-0.39 -0.25,-0.56 132.57,-0.56 132.74,-0.39 132.74,76.8 -0.01,76.8
  pour Route2: -0.28,76.52 -0.28,-0.16 -0.56,-0.44 132.57,-0.44 133.1,0.08 133.1,76.62 133.11,76.64 -0.21,76.64 -0.16,76.59
  pour Bottom: -0.25,76.29 -0.25,-0.56 -0.09,-0.72 132.07,-0.72 132.4,-0.39 132.4,76.63 132.1,76.93
I2C_SCL  (via drill 0.35)
  Top 0.254: U9.40 36.69,18.47 v36.95,18.73
  Bottom 0.254: v36.95,18.73 38.71,16.97 JP3.2
I2C_SDA  (via drill 0.35)
  Top 0.254: U9.41 36.1,18.87 36.63,19.4 v36.63,19.76
  Bottom 0.254: v36.63,19.76 51.29,19.76 JP3.1
IN2
  Top 0.312: U7.1 U4.4
  Top 0.508: U7.1
N$1
  Top 0.312: C1.2 10.67,57.06 U1.2
N$2
  Top 0.312: C2.2 10.09,56.56 U1.3
N$3
  Top 0.312: X1.P R1.1 8.76,57.77 C1.1
N$4
  Top 0.312: U1.1 11.47,57.57 8.81,60.24 C3.2
N$5
  Top 0.312: U1.14 13.77,58.81 15.25,60.29 C5.2
  Top 0.33: C5.2
N$6
  Top 0.312: U1.16 12.76,58.56 11.09,60.22 C4.2
N$7
  Top 0.312: U1.11 16.28,57.06 18.82,59.61 R3.2
N$8
  Top 0.312: U1.10 16.01,56.56 16.44,56.12 R2.2
N$9
  Top 0.312: R2.1 C7.1 C8-AC.1
N$10
  Top 0.312: C9.1 51.47,65.38 U2.4
N$11
  Top 0.312: C8.2 U2.3
N$12
  Top 0.312: U2.10 61.07,66.03 C10.1
N$13
  Top 0.312: C10.2 R8.2
N$14
  Top 0.312: U2.9 61.12,65.38 61.37,65.13
  Top 0.483: C13.1 61.36,65.12 61.37,65.13
N$15
  Top 0.312: C13.2 R11.2
N$16
  Top 0.312: R11.1 R12.1 71.77,61.43 75.03,61.43 X2.ANTENNA
N$17
  Top 0.312: U4.2 20.77,44.13
  Top 0.508: U3.15 20.77,44.13
N$18
  Top 0.312: U5.4 U3.1
N$19
  Top 0.312: X5.P U5.2
N$20
  Top 0.312: U8.2 U7.15
  Top 0.508: U7.15
N$21
  Top 0.312: U8.4 R14.1
  Top 0.508: R14.1
N$22
  Top 0.508: U7.9 R15.1
N$23
  Top 0.508: 118.51,52.6 D7.3 120.41,52.63 C32.1 119.09,53.63 117.55,53.63 116.72,54.46 IC2.1 | IC2.4 118.28,52.6 118.51,52.6 | D6.3 119.32,51.73 119.35,51.76 118.51,52.6
N$24
  Top 0.312: R14.2 C26.1
  Top 0.508: C26.1
N$25
  Top 0.312: U10.1 51.71,41.45
  Top 0.508: 51.71,41.45 C26.2 | C26.2 51.62,39.39 R17.2 | C26.2 R16.1
N$26
  Top 0.312: R18.2 73.43,42.08 86.08,29.43 C27.1
N$27
  Top 0.508: U$6.3 64.76,5.74 R25.2 74.83,11.47 74.83,19.22 76.55,20.94 82.04,20.94 82.77,20.21 U12.3
N$28
  Top 0.312: R21.2 73.11,39.5 96.76,15.85 106.31,15.85 107.25,14.9 C28.1
N$29
  Top 0.312: C28.2 X7.P
N$30
  Top 0.312: R24.2 73.27,40.8 97.12,16.95 C29.1
N$31
  Top 0.312: C29.2 X8.P
  Top 0.508: X8.P
N$32
  Top 0.483: U10.8 61.87,41.45 R18.1
N$33
  Top 0.508: U10.5 R21.1
N$34
  Top 0.508: U10.7 R24.1 | R24.1
N$35
  Top 0.508: R15.2 37.03,30.48 JP6.1
N$36
  Top 0.508: R5.2 20.77,29.68 JP7.1
N$37
  Top 0.508: U3.9 20.76,34.35 R5.1
N$38
  Top 0.312: C27.2 128.97,29.43
  Top 0.508: 128.97,29.43 X6.P
N$39
  Top 0.508: R33.1 110.98,61.83 D2.A
N$40
  Top 0.254: U12.12 82.77,10.82 R20.1
N$41
  Top 0.254: U12.10 80.23,10.84 R23.1
N$42
  Top 0.254: U12.8 77.69,10.82 R22.1
N$45
  Top 0.508: U$6.6 62.4,19.16 JP1.6
N$46
  Top 0.254: R23.2 80.2,5.48 | 80.2,5.48 X9.P | 80.2,5.48 82.78,8.06 R20.2 | 80.2,5.48 77.67,8.01 R22.2
N$47
  Top 0.508: U$6.5 64.94,19.16 JP1.4
N$48
  Top 0.508: U$6.7 59.86,19.16 JP1.8
N$49  (via drill 0.35)
  other vias: 2.17,12.43
N$50
  Top 0.254: 59.85,8.1 U$6.2
  Top 0.312: X12.P 59.85,8.1
N$51
  Top 0.312: X17.P 7.82,21.46 C49.1
N$52
  Top 0.508: IC2.3 L5.1
N$53
  Top 0.254: U6.3 11.41,18.39 11,18.81 11,21.13 10.69,21.45 C49.2
N$54
  Top 0.508: L5.2 110.94,55.9 C34.1 | R28.1 C34.1 | C34.1 C35.1 | C35.1 | C35.1 107.99,55.91 R30.1
N$55
  Top 0.254: U6.5 11.54,17.59 10.62,18.52 10.62,19.62 10.36,19.88 R37.2
N$56
  Top 0.305: X18.P BALUN1.1
N$57
  Top 0.305: BALUN1.4 13.55,8.95 C51.1
N$58
  Top 0.254: C53.1 2.81,16.67 R38.1
N$59
  Top 0.254: U6.12 11.68,14.79 11.45,14.56 11.45,11.83 11.2,11.58 C57.1 10.23,10.57 R39.2
N$60
  Top 0.254: C56.1 9.07,10.59 R39.1
N$61
  Top 0.254: U6.31 18.89,17.19 C94.1
N$62
  Top 0.254: U6.6 11.4,17.19 10.35,18.24 C58.1
N$63
  Top 0.254: U6.7 11.26,16.79 10.74,17.32 9.88,17.32 C59.1
N$64
  Top 0.254: U6.10 11.08,15.59 10.22,14.74 C60.1
N$65  (via drill 0.35)
  Top 0.254: U6.20 15.68,14.08 15.68,13.2 16.82,12.06 C66.1 19.97,12.49 v19.97,12.97 | U6.44 14.47,20.68 14.73,20.94 14.73,23.09 C67.1 14.91,23.36 v15.75,23.36
  Route15 0.254: v15.75,23.36 17.44,23.36 17.81,23 17.81,15.71 19.97,13.55 v19.97,12.97
N$66
  Top 0.254: C79.1 36.76,23.97 36.38,23.59 35.11,23.59 34.83,23.3 U9.1
N$67
  Top 0.254: U9.32 33.23,15.11 32.91,14.79 31.05,14.79 30.48,14.22 C80.1
N$68
  Top 0.254: U9.33 33.63,14.78 33.26,14.4 31.55,14.4 31.41,14.26 C81.1
N$69
  Top 0.254: U9.46 36.46,20.87 38.22,19.12 L1.1 38.22,18.42 38.65,17.99 41.29,17.99 C82.1
N$70
  Top 0.254: L2.1 39.64,19.06 L1.2
N$71
  Top 0.254: U9.47 36.61,21.27 37.23,20.64 L2.2
N$72
  Top 0.508: U11.5 104.46,51.69 L3.1
N$73
  Top 0.508: U11.4 102.58,51.78 L3.2 | L3.2 L4.1 | L3.2 C90.1
N$74
  Top 0.254: U6.8 11.09,16.39 10.8,16.68 6.62,16.68 C54.1 5.35,16.64 R38.2
N$75
  Top 0.254: U6.42 15.27,21.1 16.72,22.56 C95.1
N$76
  Top 0.305: BALUN1.3 14.85,8.99 C50.1
N$77
  Top 0.508: C34.2 110.99,57.61 R28.2 114.41,57.61 R29.1 114.43,56.81 114.91,56.32 117.5,56.32 118.26,55.56 IC2.5
N$78
  Top 0.216: SB1.2 39.97,16.05 37.94,18.07 U9.39
N$79
  Top 0.305: IC3.11 104.75,38.54 104.24,39.05 SB2.1
N$80
  Top 0.305: IC3.12 103.08,38.04 R31.2
N$81
  Top 0.305: R31.1 100.62,38.03 100.28,37.7 SB4.1
N$82
  Top 0.216: IC3.14 SB5.1
PORT_N
  Top 0.241: U6.17 14.47,10.6 C50.2
PORT_P
  Top 0.241: U6.16 14.07,10.67 C51.2
PPS
  Top 0.254: U12.11 81.5,15.92 | 81.5,15.92 U12.4 | U12.9 78.96,15.45 79.43,15.92 81.5,15.92 | U12.13 84.04,15.5 | 81.5,15.92 83.62,15.92 84.04,15.5 | U12.1 85.31,16.77 84.04,15.5
PPS_OUT
  Top 0.254: U12.2 84.04,19.93 84.54,20.43 88.36,20.43 88.83,19.96 JP9.1
Q1  (via drill 0.35)
  Top 0.216: U3.3 v13.06,42.87 | U7.5 25.98,38.39 v25.94,38.43
  Bottom 0.216: v13.06,42.87 16.23,39.7 24.07,39.7 25.34,38.43 v25.94,38.43
RESET
  Top 0.508: U$6.4 66.87,8.11 67.5,8.73 JP1.2 67.52,19.16 R19.2
RESETN  (via drill 0.35)
  Top 0.216: U9.24 29.07,17.27 28.68,16.88 28.68,6.95 29.1,6.54 RESET.4 RESET.3 46.92,6.54 47.85,7.46 47.85,22.92 48.31,23.39 v53.97,23.39 | v98.61,37.84 98.61,39.04 SB2.2
  Bottom 0.216: v53.97,23.39 97.23,23.39 98.61,24.77 v98.61,37.84
SINE_WAVE
  Top 0.312: FL1.8 42.51,66.03 R4.1 | R4.1 C8.1
  Top 0.762: R4.1
SPI_CLK
  Top 0.216: U6.41 15.67,20.94 16.43,21.71 21.89,21.71 22.79,20.8 | 22.79,20.8 | 22.79,20.8 22.9,20.69 26.26,20.69 27.51,19.45 28.86,19.45 29.04,19.27 U9.19
SPI_MISO
  Top 0.216: U6.40 16.07,20.86 16.57,21.36 21.74,21.36 22.56,20.55 22.56,19.13 23.11,18.58 28.57,18.58 28.68,18.47 U9.21
SPI_MOSI
  Top 0.216: U6.39 16.47,20.77 16.68,20.99 21.63,20.99 22.2,20.42 22.2,17.91 22.84,17.27 28.58,17.27 28.95,17.64 29.6,17.64 U9.23
SPIS_CLK
  Top 0.216: U7.4 30.21,39.66 30.78,39.09 30.78,28.84 | U3.4 13.63,41.6 14.54,40.69 14.54,27.91 14.83,27.62 29.55,27.62 30.78,28.84 | U9.6 32.83,24 30.78,26.05 30.78,28.84
SPIS_MOSI
  Top 0.216: U3.5 13.75,40.33 14.19,39.89 14.19,27.72 14.71,27.2 27.72,27.2 32,22.92 32,22.5 U9.8
SWD_CLK  (via drill 0.35)
  Top 0.216: v29.4,14.84 29.4,15.04 30.43,16.07 U9.25 | SB4.2 v100.28,33.65
  Bottom 0.216: v29.4,14.84 29.4,8.02 30.22,7.19 98.96,7.19 100.28,8.52 v100.28,33.65
SWD_DIO  (via drill 0.35)
  Top 0.216: v30.43,15.14 30.43,15.5 30.83,15.89 U9.26 | v108.15,31.24 SB5.2
  Route15 0.216: v30.43,15.14 30.43,7.02 31.81,5.64 107.03,5.64 108.16,6.77 v108.16,31.23 v108.15,31.24
SYNC  (via drill 0.35)
  Top 0.216: U6.29 18.95,16.39 19.45,16.89 27.34,16.89 28.3,15.94 28.3,3.84 JP8.1
  Top 0.254: SB1.1 v39.97,12.37 v39.95,12.36
  Route2 0.254: v39.95,12.36 39.95,1.63 39.46,1.14 28.79,1.14 28.36,1.57 JP8.1
UART_RX  (via drill 0.35)
  Top 0.216: U9.14 28.25,21.27 v27.69,21.82
  Top 0.305: IC3.30 116.46,40.54 116.86,40.14 118.68,40.14 v118.7,40.17
  Bottom 0.216: v118.7,40.17 86.69,40.17 85.99,39.47 85.99,27.95 85.42,27.38 34.83,27.38 34.45,27 34.45,22.17 34.1,21.82 v27.69,21.82
UART_TX  (via drill 0.35)
  Top 0.216: v32.12,23.79 32.43,23.48 U9.7
  Top 0.305: IC3.31 116.98,41.04 v117.2,40.82
  Bottom 0.216: v117.2,40.82 86.26,40.82 85.46,40.03 85.46,28.51 84.83,27.88 32.54,27.88 32.12,27.46 v32.12,23.79
UV5
  Top 0.508: D8.1 122.23,49.96 D6.1
VDD_CLK
  Top 0.254: U6.9 10.25,15.99 C52.1 10.24,15.55 10.02,15.32 6.7,15.32 C54.2 6.56,15.42 C53.2
VDD_VCO
  Top 0.254: U6.11 11.29,15.18 11.06,14.95 11.06,13.95 10.88,13.77 C55.1 C57.2 9.08,12.78 C56.2
VDDPA1
  Top 0.254: U6.18 14.87,12.92 16.44,11.35 C69.1 C70.1 C71.1 FL2.1
VDDPA2
  Top 0.254: U6.19 15.28,14.08 15.28,13.06 16.66,11.68 18.53,11.68 19.1,11.11 19.62,11.11 C75.1 19.62,10.12 C74.1 19.61,9.23 C73.1 FL3.1 20.95,8.17 C76.1
VENV
  Top 0.312: C8-AC.2 FL1.1
  Top 0.762: FL1.1
VIN
  Top 0.508: J2.1 119.17,67.82 C21.1 | C21.1 115.61,67.8 IC1.3 | JP4.1 123.8,63.43 121.65,65.58 120.12,65.58 119.19,66.5 C21.1
VIN_O
  Top 0.508: D7.1 121.65,51.65 121.4,51.91 121.4,54.77 123.86,57.23 123.86,59.56 JP4.2
VOUT_5V
  Top 0.508: D1.2 IC1.2 IC1.4 108.37,74.07 C25.1
VRMS
  Top 0.312: R3.1 19.54,60.33 C6.1 20.89,61.68 X3.P
VUSB
  Top 0.508: J1.1 127.21,51.19 126.78,51.19 126.29,50.7 JP5.1
VUSB_O  (via drill 0.35)
  Top 0.508: v122.3,45.72 D8.2
  Route15 0.508: JP5.2 125.65,41.42 123.08,41.42 122.3,42.19 v122.3,45.72
XC1
  Top 0.216: U9.34 34.05,16.45 34.05,13.72 Y1.1 32.86,13.7 C42.1
XC2
  Top 0.216: C43.1 35.05,11.14 Y1.3 35.98,12.43 36.33,12.78 36.33,14.92 35.95,15.3 35.01,15.3 34.43,15.89 U9.35
XL1
  Top 0.254: U9.2 34.43,23.91 35.48,24.96 Y2.1 C77.1
XL2
  Top 0.254: U9.3 34.03,23.91 33.04,24.9 Y2.2 C78.1